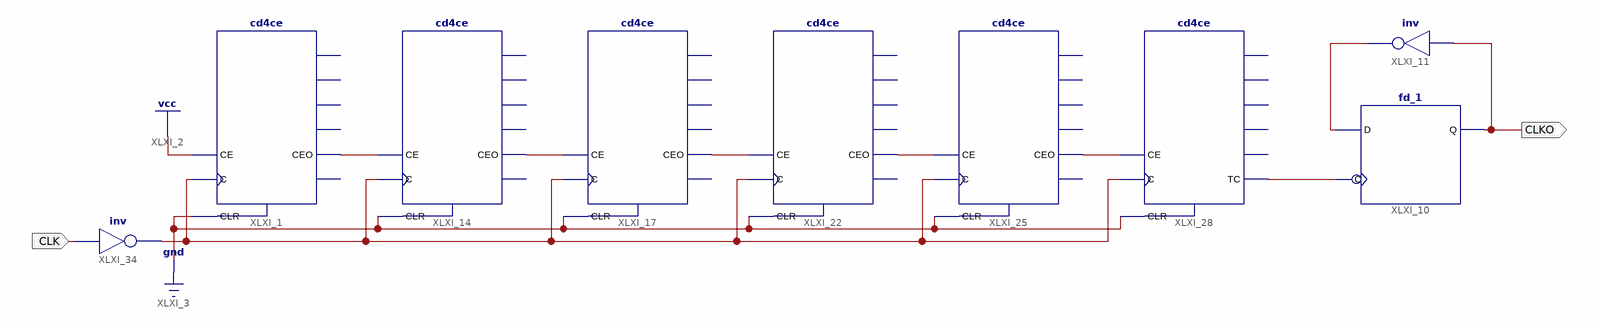
[diagram p0: schematic sheet 1]
// Xilinx ISE schematic clkdiv2M.sch (spartan6) as structural Verilog: 9 symbols, 2 ports
module clkdiv2M (
  input  CLK,
  output CLKO
);

  wire CLK_I, XLXN_9, XLXN_14, XLXN_27, XLXN_37, XLXN_44, XLXN_51, XLXN_53;

  cd4ce XLXI_1 (.C(CLK_I), .CE(1'b1), .CLR(1'b0), .CEO(XLXN_14));  // open: Q0, Q1, Q2, Q3, TC
  cd4ce XLXI_14 (.C(CLK_I), .CE(XLXN_14), .CLR(1'b0), .CEO(XLXN_27));  // open: Q0, Q1, Q2, Q3, TC
  cd4ce XLXI_17 (.C(CLK_I), .CE(XLXN_27), .CLR(1'b0), .CEO(XLXN_37));  // open: Q0, Q1, Q2, Q3, TC
  cd4ce XLXI_22 (.C(CLK_I), .CE(XLXN_37), .CLR(1'b0), .CEO(XLXN_44));  // open: Q0, Q1, Q2, Q3, TC
  cd4ce XLXI_25 (.C(CLK_I), .CE(XLXN_44), .CLR(1'b0), .CEO(XLXN_51));  // open: Q0, Q1, Q2, Q3, TC
  cd4ce XLXI_28 (.C(CLK_I), .CE(XLXN_51), .CLR(1'b0), .TC(XLXN_53));  // open: CEO, Q0, Q1, Q2, Q3
  fd_1 XLXI_10 (.C(XLXN_53), .D(XLXN_9), .Q(CLKO));
  not XLXI_11 (XLXN_9, CLKO);
  not XLXI_34 (CLK_I, CLK);
endmodule
